# EAGLE schematic MainECU rev11 (EAGLE 9.6.2)

## Sheet 1 of 5
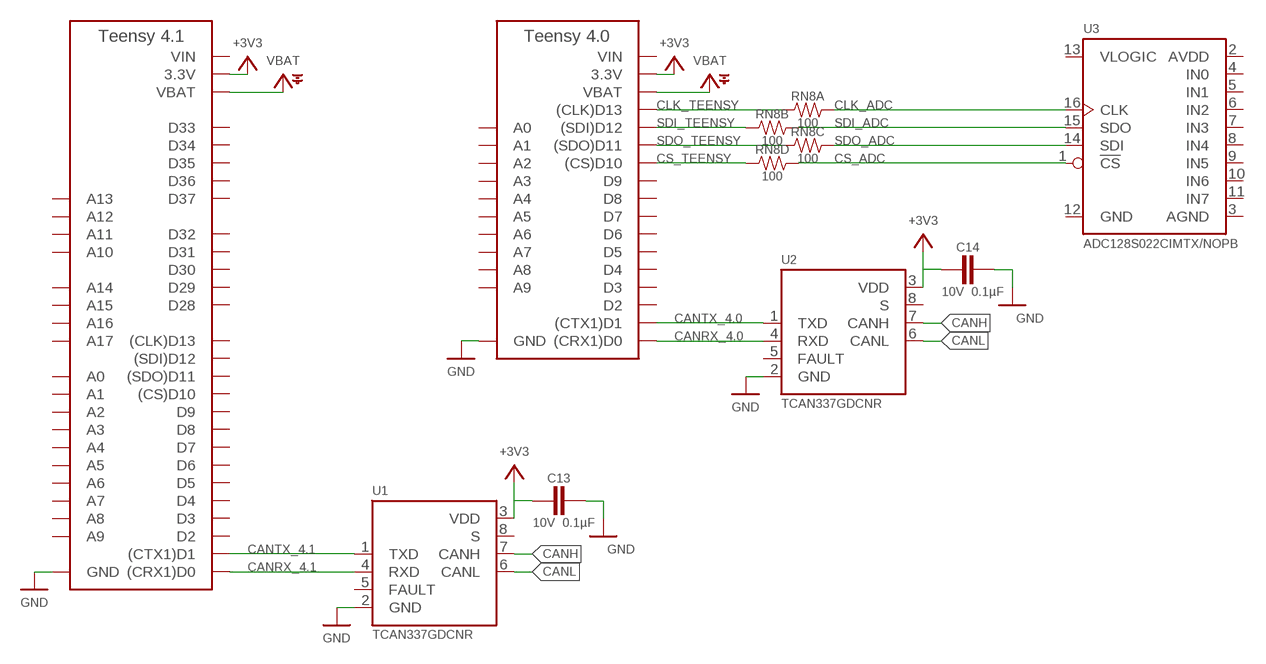
[diagram p0: schematic, sheet 1]

### Parts
A1  TEENSY_4.1  [TEENSY_LONG_EXT]
A2  TEENSY_4.0_VBAT  [TEENSY_SHORT_VBAT]
C13  CAPACITOR_0603_10V_0.1UF  [0603-CAP]
C14  CAPACITOR_0603_10V_0.1UF  [0603-CAP]
RN8  RESISTOR_NETWORK_4_100  [1206-RES]
U1  CAN_TRANSCIEVER_TCAN337G  [SOT-23-8]
U2  CAN_TRANSCIEVER_TCAN337G  [SOT-23-8]
U3  ADC128S022  [TSSOP-16]

### Nets
+3V1: C13.2
+3V2: C14.2
+3V3: A1.3V3(3.3V) A1.3V3@2(3.3V) A1.3V3@3(3.3V) A2.3.3V U1.3(VDD) U2.3(VDD) ; also sheet 2,3,4,5
CANH: U1.7(CANH) U2.7(CANH)
CANL: U1.6(CANL) U2.6(CANL)
CANRX_4.0: A2.D0((CRX1)D0) U2.4(RXD)
CANRX_4.1: A1.D0((CRX1)D0) U1.4(RXD)
CANTX_4.0: A2.D1((CTX1)D1) U2.1(TXD)
CANTX_4.1: A1.D1((CTX1)D1) U1.1(TXD)
CLK_ADC: RN8.8 U3.16(CLK)
CLK_TEENSY: A2.D13((CLK)D13) RN8.1
CS_ADC: RN8.5 U3.1(!CS!)
CS_TEENSY: A2.D10((CS)D10) RN8.4
GND: A1.AGND/GND(GND) A1.GND A1.GND@2(GND) A2.AGND/GND(GND) A2.GND C13.1 C14.1 U1.2(GND) U2.2(GND) ; also sheet 2,3,4,5
SDI_ADC: RN8.7 U3.15(SDO)
SDI_TEENSY: A2.D12((SDI)D12) RN8.2
SDO_ADC: RN8.6 U3.14(SDI)
SDO_TEENSY: A2.D11((SDO)D11) RN8.3
VBAT: A1.VBAT A2.VBAT
Unconnected: A1.D2 A1.D3 A1.D4 A1.D5 A1.D6 A1.D7 A1.D8 A1.D9 A1.D10((CS)D10) A1.D11((SDO)D11) A1.D12((SDI)D12) A1.D13((CLK)D13) A1.D14(A0) A1.D15(A1) A1.D16(A2) A1.D17(A3) A1.D18(A4) A1.D19(A5) A1.D20(A6) A1.D21(A7) A1.D22(A8) A1.D23(A9) A1.D24(A10) A1.D25(A11) A1.D26(A12) A1.D27(A13) A1.D28 A1.D29 A1.D30 A1.D31 A1.D32 A1.D33 A1.D34 A1.D35 A1.D36 A1.D37 A1.D38(A14) A1.D39(A15) A1.D40(A16) A1.D41(A17) A2.D2 A2.D3 A2.D4 A2.D5 A2.D6 A2.D7 A2.D8 A2.D9 A2.D14(A0) A2.D15(A1) A2.D16(A2) A2.D17(A3) A2.D18(A4) A2.D19(A5) A2.D20(A6) A2.D21(A7) A2.D22(A8) A2.D23(A9) U1.5(FAULT) U1.8(S) U2.5(FAULT) U2.8(S) U3.4(IN0) U3.5(IN1) U3.6(IN2) U3.7(IN3) U3.8(IN4) U3.9(IN5) U3.10(IN6) U3.11(IN7)

## Sheet 2 of 5: Wheel speed
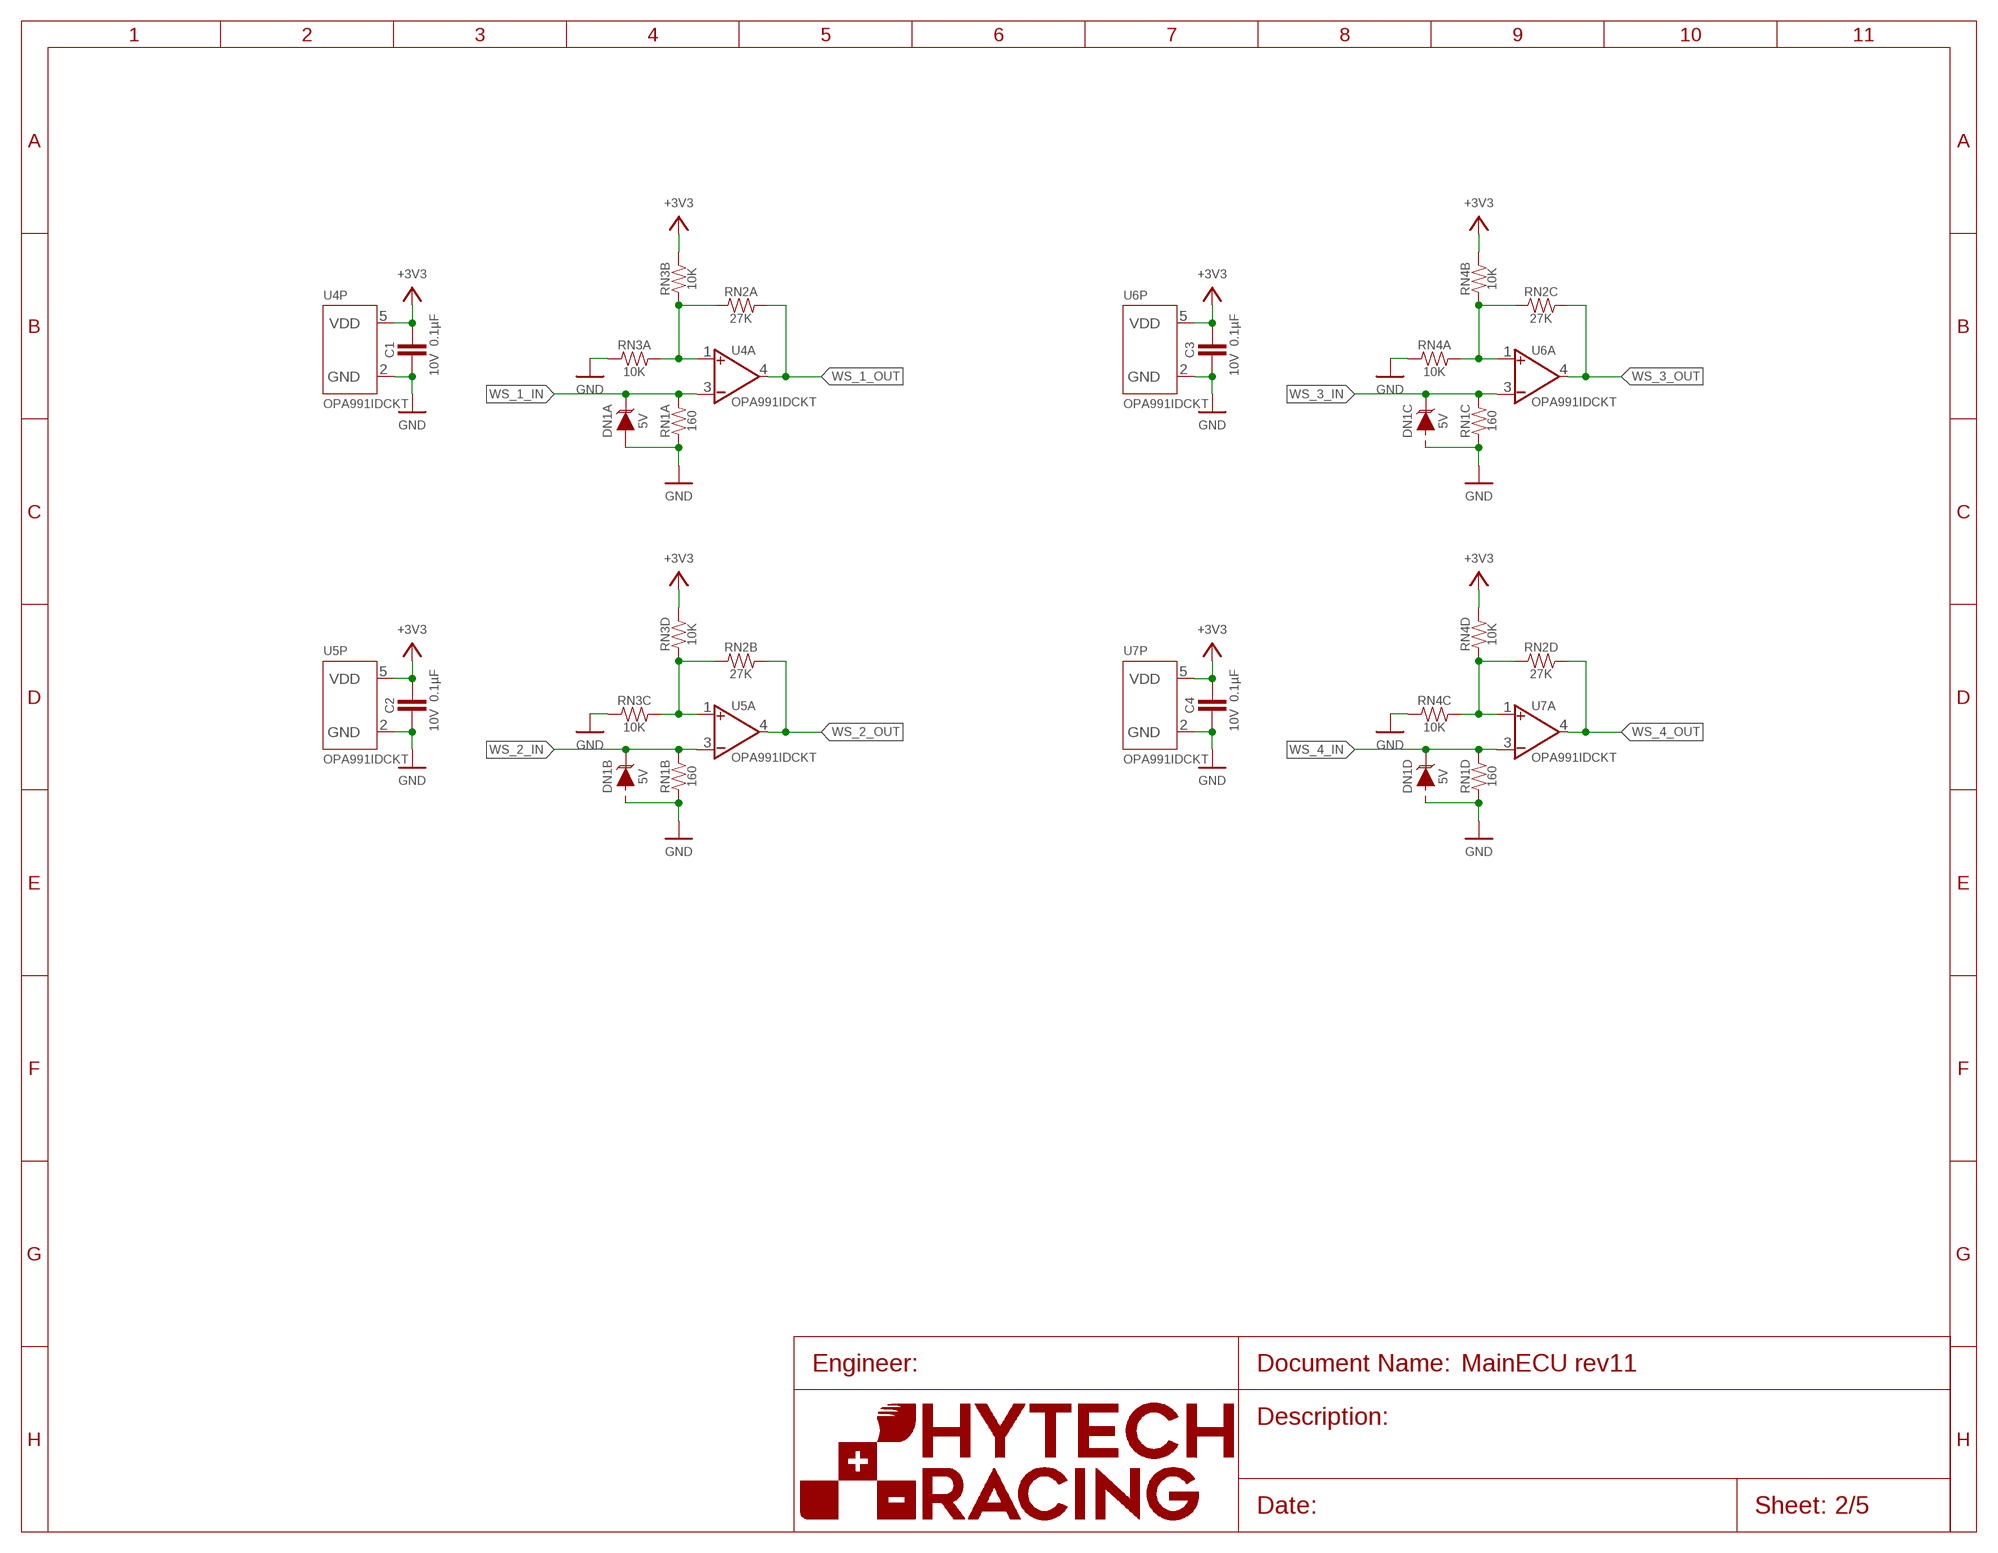
[diagram p1: schematic, sheet 2]
U$3 (FRAME_A): FRAME_DESCRIPTION: Default; ORIENTATION: LANDSCAPE; SIZE: A

### Parts
C1  CAPACITOR_0603_10V_0.1UF  [0603-CAP]
C2  CAPACITOR_0603_10V_0.1UF  [0603-CAP]
C3  CAPACITOR_0603_10V_0.1UF  [0603-CAP]
C4  CAPACITOR_0603_10V_0.1UF  [0603-CAP]
DN1  TVS_ARRAY_5V  [SOT363]
RN1  RESISTOR_NETWORK_4_160  [1206-RES]
RN2  RESISTOR_NETWORK_4_27K  [1206-RES]
RN3  RESISTOR_NETWORK_4_10K  [1206-RES]
RN4  RESISTOR_NETWORK_4_10K  [1206-RES]
U4  OPAMP_1_CHANNEL_OPA991  [SC-70-5]
U5  OPAMP_1_CHANNEL_OPA991  [SC-70-5]
U6  OPAMP_1_CHANNEL_OPA991  [SC-70-5]
U7  OPAMP_1_CHANNEL_OPA991  [SC-70-5]

### Nets
+3V3: C1.1 C2.1 C3.1 C4.1 RN3.5 RN3.7 RN4.5 RN4.7 U4.5(P:VDD) U5.5(P:VDD) U6.5(P:VDD) U7.5(P:VDD) ; also sheet 1,3,4,5
GND: C1.2 C2.2 C3.2 C4.2 DN1.2(A:A) RN1.1 RN1.2 RN1.3 RN1.4 RN3.1 RN3.3 RN4.1 RN4.3 U4.2(P:GND) U5.2(P:GND) U6.2(P:GND) U7.2(P:GND) ; also sheet 1,3,4,5
N$9: RN2.2 RN3.4 RN3.6 U5.1(A:VIN+)
N$10: RN2.3 RN4.2 RN4.8 U6.1(A:VIN+)
N$11: RN2.1 RN3.2 RN3.8 U4.1(A:VIN+)
N$12: RN2.4 RN4.4 RN4.6 U7.1(A:VIN+)
WS_1_IN: DN1.1(A:C) RN1.8 U4.3(A:VIN-)
WS_1_OUT: RN2.8 U4.4(A:VOUT)
WS_2_IN: DN1.3(B:C) RN1.7 U5.3(A:VIN-)
WS_2_OUT: RN2.7 U5.4(A:VOUT)
WS_3_IN: DN1.4(C:C) RN1.6 U6.3(A:VIN-)
WS_3_OUT: RN2.6 U6.4(A:VOUT)
WS_4_IN: DN1.5(D:C) RN1.5 U7.3(A:VIN-)
WS_4_OUT: RN2.5 U7.4(A:VOUT)
Unconnected: DN1.6(E:C)

## Sheet 3 of 5: BSPD
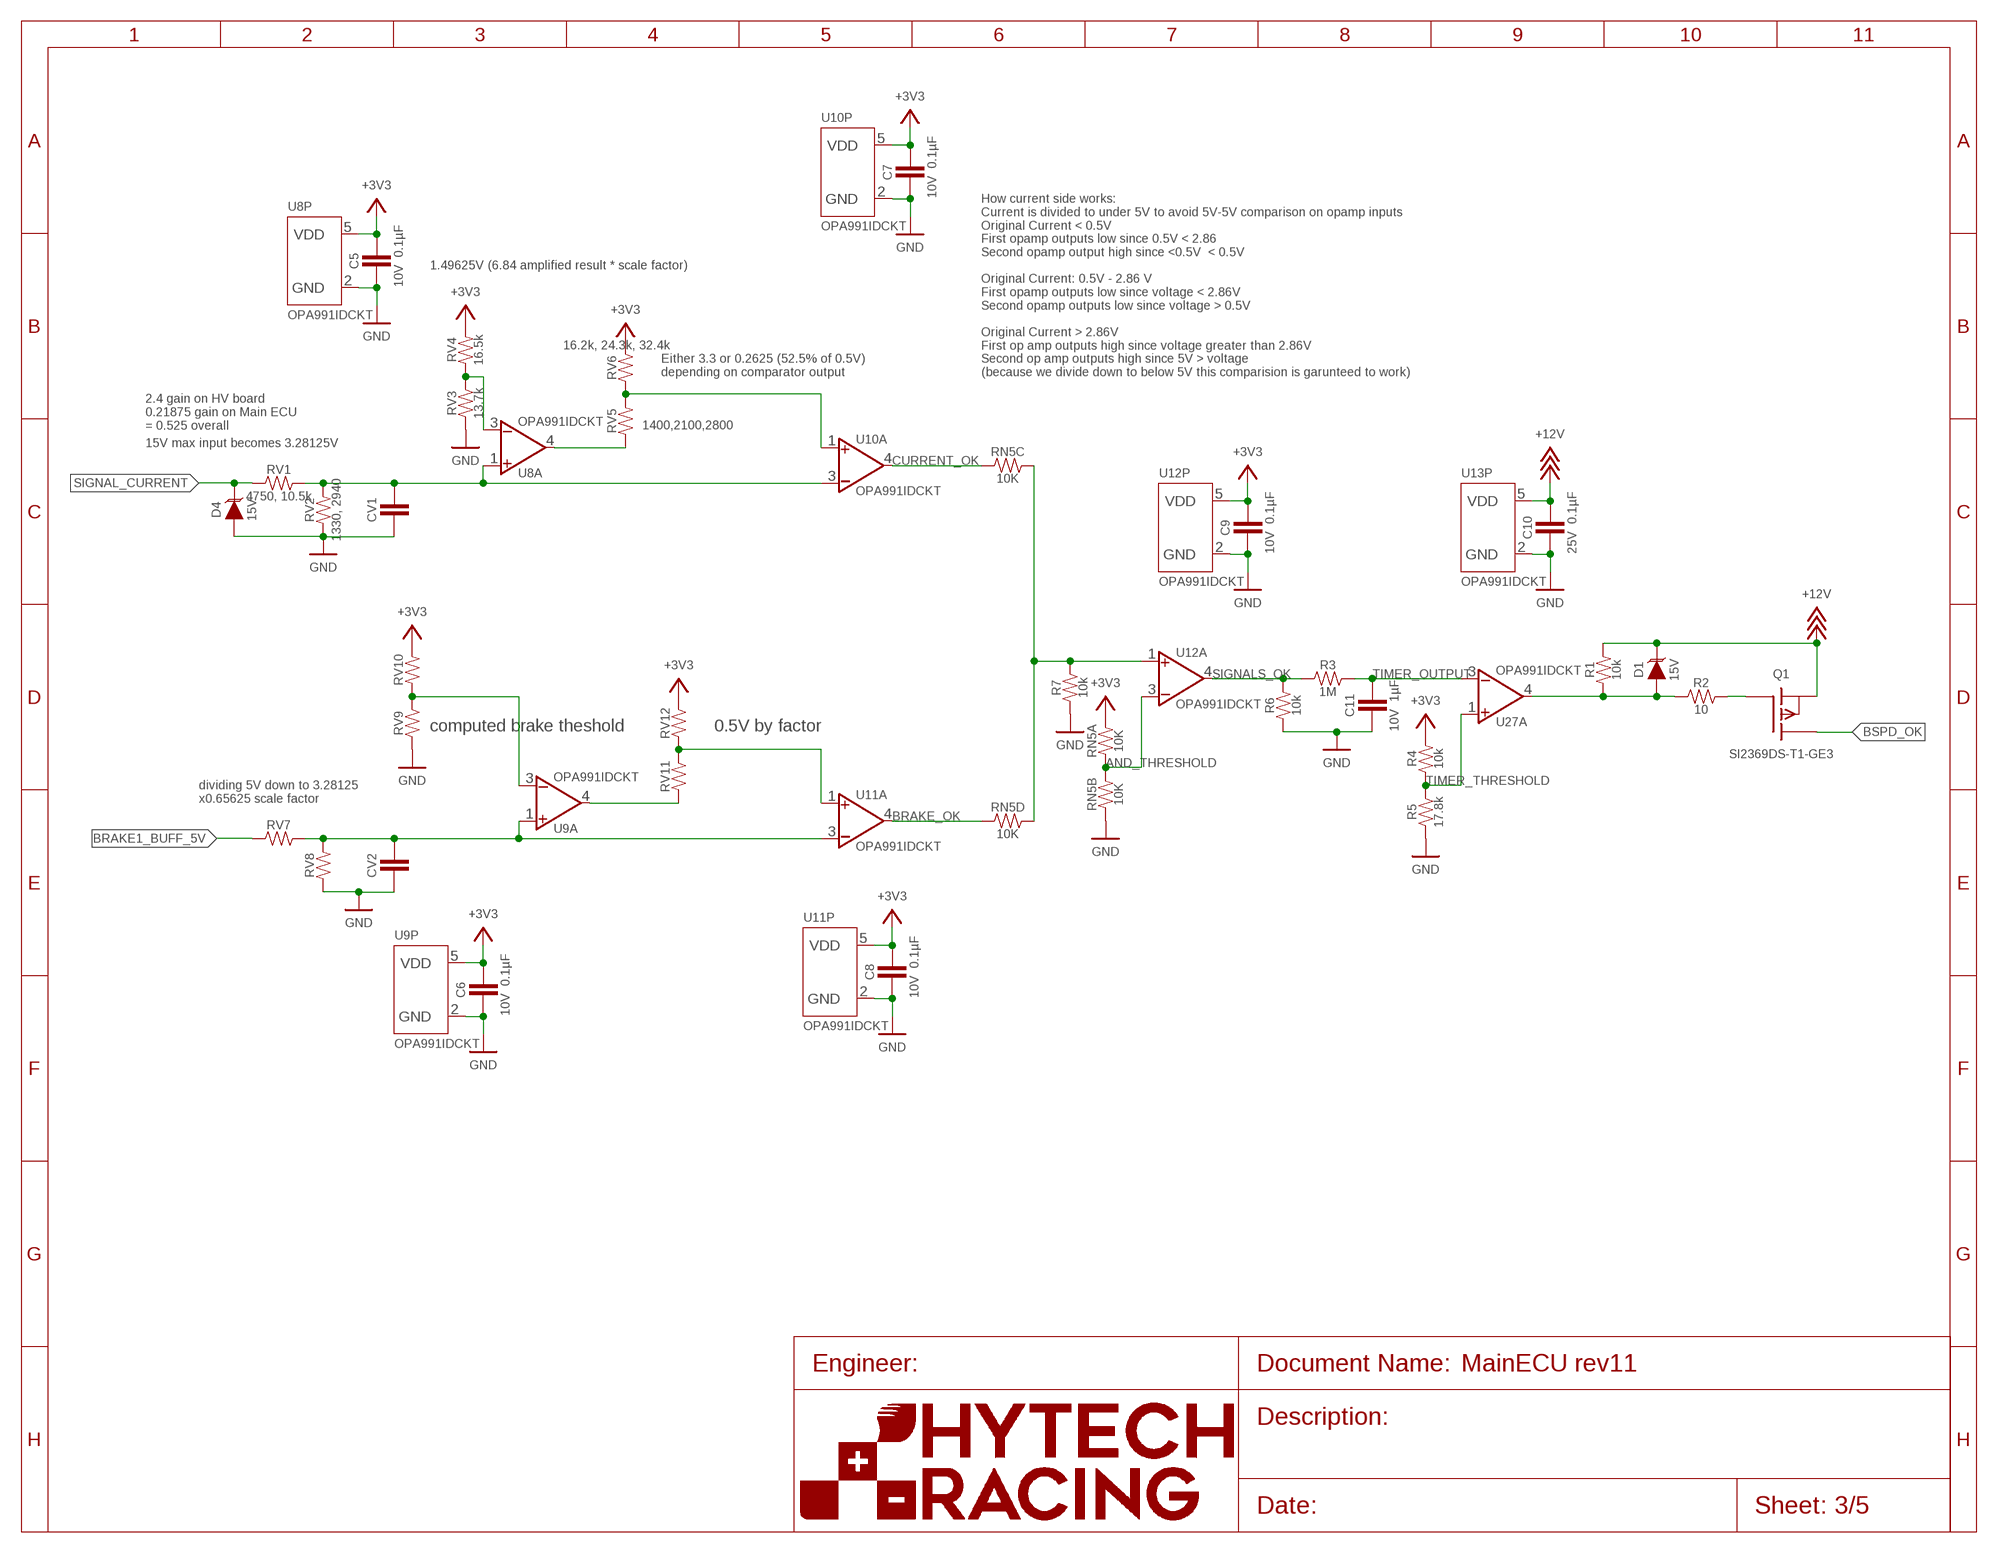
[diagram p2: schematic, sheet 3]
U$4 (FRAME_A): FRAME_DESCRIPTION: Default; ORIENTATION: LANDSCAPE; SIZE: A

### Parts
C5  CAPACITOR_0603_10V_0.1UF  [0603-CAP]
C6  CAPACITOR_0603_10V_0.1UF  [0603-CAP]
C7  CAPACITOR_0603_10V_0.1UF  [0603-CAP]
C8  CAPACITOR_0603_10V_0.1UF  [0603-CAP]
C9  CAPACITOR_0603_10V_0.1UF  [0603-CAP]
C10  CAPACITOR_0603_25V_0.1UF  [0603-CAP]
C11  CAPACITOR_0603_10V_1UF  [0603-CAP]
CV1  CAPACITOR_VALUE  [0603-CAP]
CV2  CAPACITOR_VALUE  [0603-CAP]
D1  TVS_15V  [SOT-23]
D4  TVS_15V  [SOT-23]
Q1  TRANSISTOR_P_MOS_SOT23_SI2369DS-T1-GE3  [SOT-23]
R1  RESISTOR_0603_10K  [0603-RES]
R2  RESISTOR_0603_10  [0603-RES]
R3  RESISTOR_0603_1M  [0603-RES]
R4  RESISTOR_0603_10K  [0603-RES]
R5  RESISTOR_0603_17.8K  [0603-RES]
R6  RESISTOR_0603_10K  [0603-RES]
R7  RESISTOR_0603_10K  [0603-RES]
RN5  RESISTOR_NETWORK_4_10K  [1206-RES]
RV1  4750, 10.5k  RESISTOR_VALUE  [0603-RES]
RV2  1330, 2940  RESISTOR_VALUE  [0603-RES]
RV3  13.7k  RESISTOR_VALUE  [0603-RES]
RV4  16.5k  RESISTOR_VALUE  [0603-RES]
RV5  1400,2100,2800  RESISTOR_VALUE  [0603-RES]
RV6  16.2k, 24.3k, 32.4k  RESISTOR_VALUE  [0603-RES]
RV7  RESISTOR_VALUE  [0603-RES]
RV8  RESISTOR_VALUE  [0603-RES]
RV9  RESISTOR_VALUE  [0603-RES]
RV10  RESISTOR_VALUE  [0603-RES]
RV11  RESISTOR_VALUE  [0603-RES]
RV12  RESISTOR_VALUE  [0603-RES]
U8  OPAMP_1_CHANNEL_OPA991  [SC-70-5]
U9  OPAMP_1_CHANNEL_OPA991  [SC-70-5]
U10  OPAMP_1_CHANNEL_OPA991  [SC-70-5]
U11  OPAMP_1_CHANNEL_OPA991  [SC-70-5]
U12  OPAMP_1_CHANNEL_OPA991  [SC-70-5]
U13  OPAMP_1_CHANNEL_OPA991  [SC-70-5]
U27  OPAMP_1_CHANNEL_OPA991  [SC-70-5]

### Nets
+3V3: C5.1 C6.1 C7.1 C8.1 C9.1 R4.2 RN5.8 RV4.2 RV6.2 RV10.2 RV12.2 U8.5(P:VDD) U9.5(P:VDD) U10.5(P:VDD) U11.5(P:VDD) U12.5(P:VDD) ; also sheet 1,2,4,5
+12V: C10.1 D1.3(C) Q1.2(S) R1.2 U13.5(P:VDD) ; also sheet 4
AND_THRESHOLD: RN5.1 RN5.7 U12.3(A:VIN-)
BRAKE1_BUFF_5V: RV7.1 ; also sheet 5
BRAKE_OK: RN5.4 U11.4(A:VOUT)
BSPD_OK: Q1.3(D)
CURRENT_OK: RN5.3 U10.4(A:VOUT)
GND: C5.2 C6.2 C7.2 C8.2 C9.2 C10.2 C11.2 CV1.2 CV2.2 D4.1(A) R5.1 R6.1 R7.1 RN5.2 RV2.1 RV3.1 RV8.1 RV9.1 U8.2(P:GND) U9.2(P:GND) U10.2(P:GND) U11.2(P:GND) U12.2(P:GND) U13.2(P:GND) ; also sheet 1,2,4,5
N$14: D1.1(A) R1.1 R2.1 U27.4(A:VOUT)
N$15: Q1.1(G) R2.2
N$19: R7.2 RN5.5 RN5.6 U12.1(A:VIN+)
N$23: RV3.2 RV4.1 U8.3(A:VIN-)
N$24: RV5.1 U8.4(A:VOUT)
N$25: RV5.2 RV6.1 U10.1(A:VIN+)
N$26: CV1.1 RV1.2 RV2.2 U8.1(A:VIN+) U10.3(A:VIN-)
N$28: RV9.2 RV10.1 U9.3(A:VIN-)
N$29: RV11.2 RV12.1 U11.1(A:VIN+)
N$30: CV2.1 RV7.2 RV8.2 U9.1(A:VIN+) U11.3(A:VIN-)
N$31: RV11.1 U9.4(A:VOUT)
SIGNAL_CURRENT: D4.3(C) RV1.1
SIGNALS_OK: R3.1 R6.2 U12.4(A:VOUT)
TIMER_OUTPUT: C11.1 R3.2 U27.3(A:VIN-)
TIMER_THRESHOLD: R4.1 R5.2 U27.1(A:VIN+)
Unconnected: U13.1(A:VIN+) U13.3(A:VIN-) U13.4(A:VOUT)

### Notes on the sheet
- 1.49625V (6.84 amplified result * scale factor)
- Either 3.3 or 0.2625 (52.5% of 0.5V)
  depending on comparator output
- How current side works:
  Current is divided to under 5V to avoid 5V-5V comparison on opamp inputs
  Original Current < 0.5V
  First opamp outputs low since 0.5V < 2.86
  Second opamp output high since <0.5V  < 0.5V
  
  Original Current: 0.5V - 2.86 V
  First opamp outputs low since voltage < 2.86V
  Second opamp outputs low since voltage > 0.5V
  
  Original Current > 2.86V
  First op amp outputs high since voltage greater than 2.86V
  Second op amp outputs high since 5V > voltage
  (because we divide down to below 5V this comparision is garunteed to work)
- 2.4 gain on HV board
  0.21875 gain on Main ECU
  = 0.525 overall
- 15V max input becomes 3.28125V
- computed brake theshold | 0.5V by factor
- dividing 5V down to 3.28125
  x0.65625 scale factor

## Sheet 4 of 5: Software shutdown
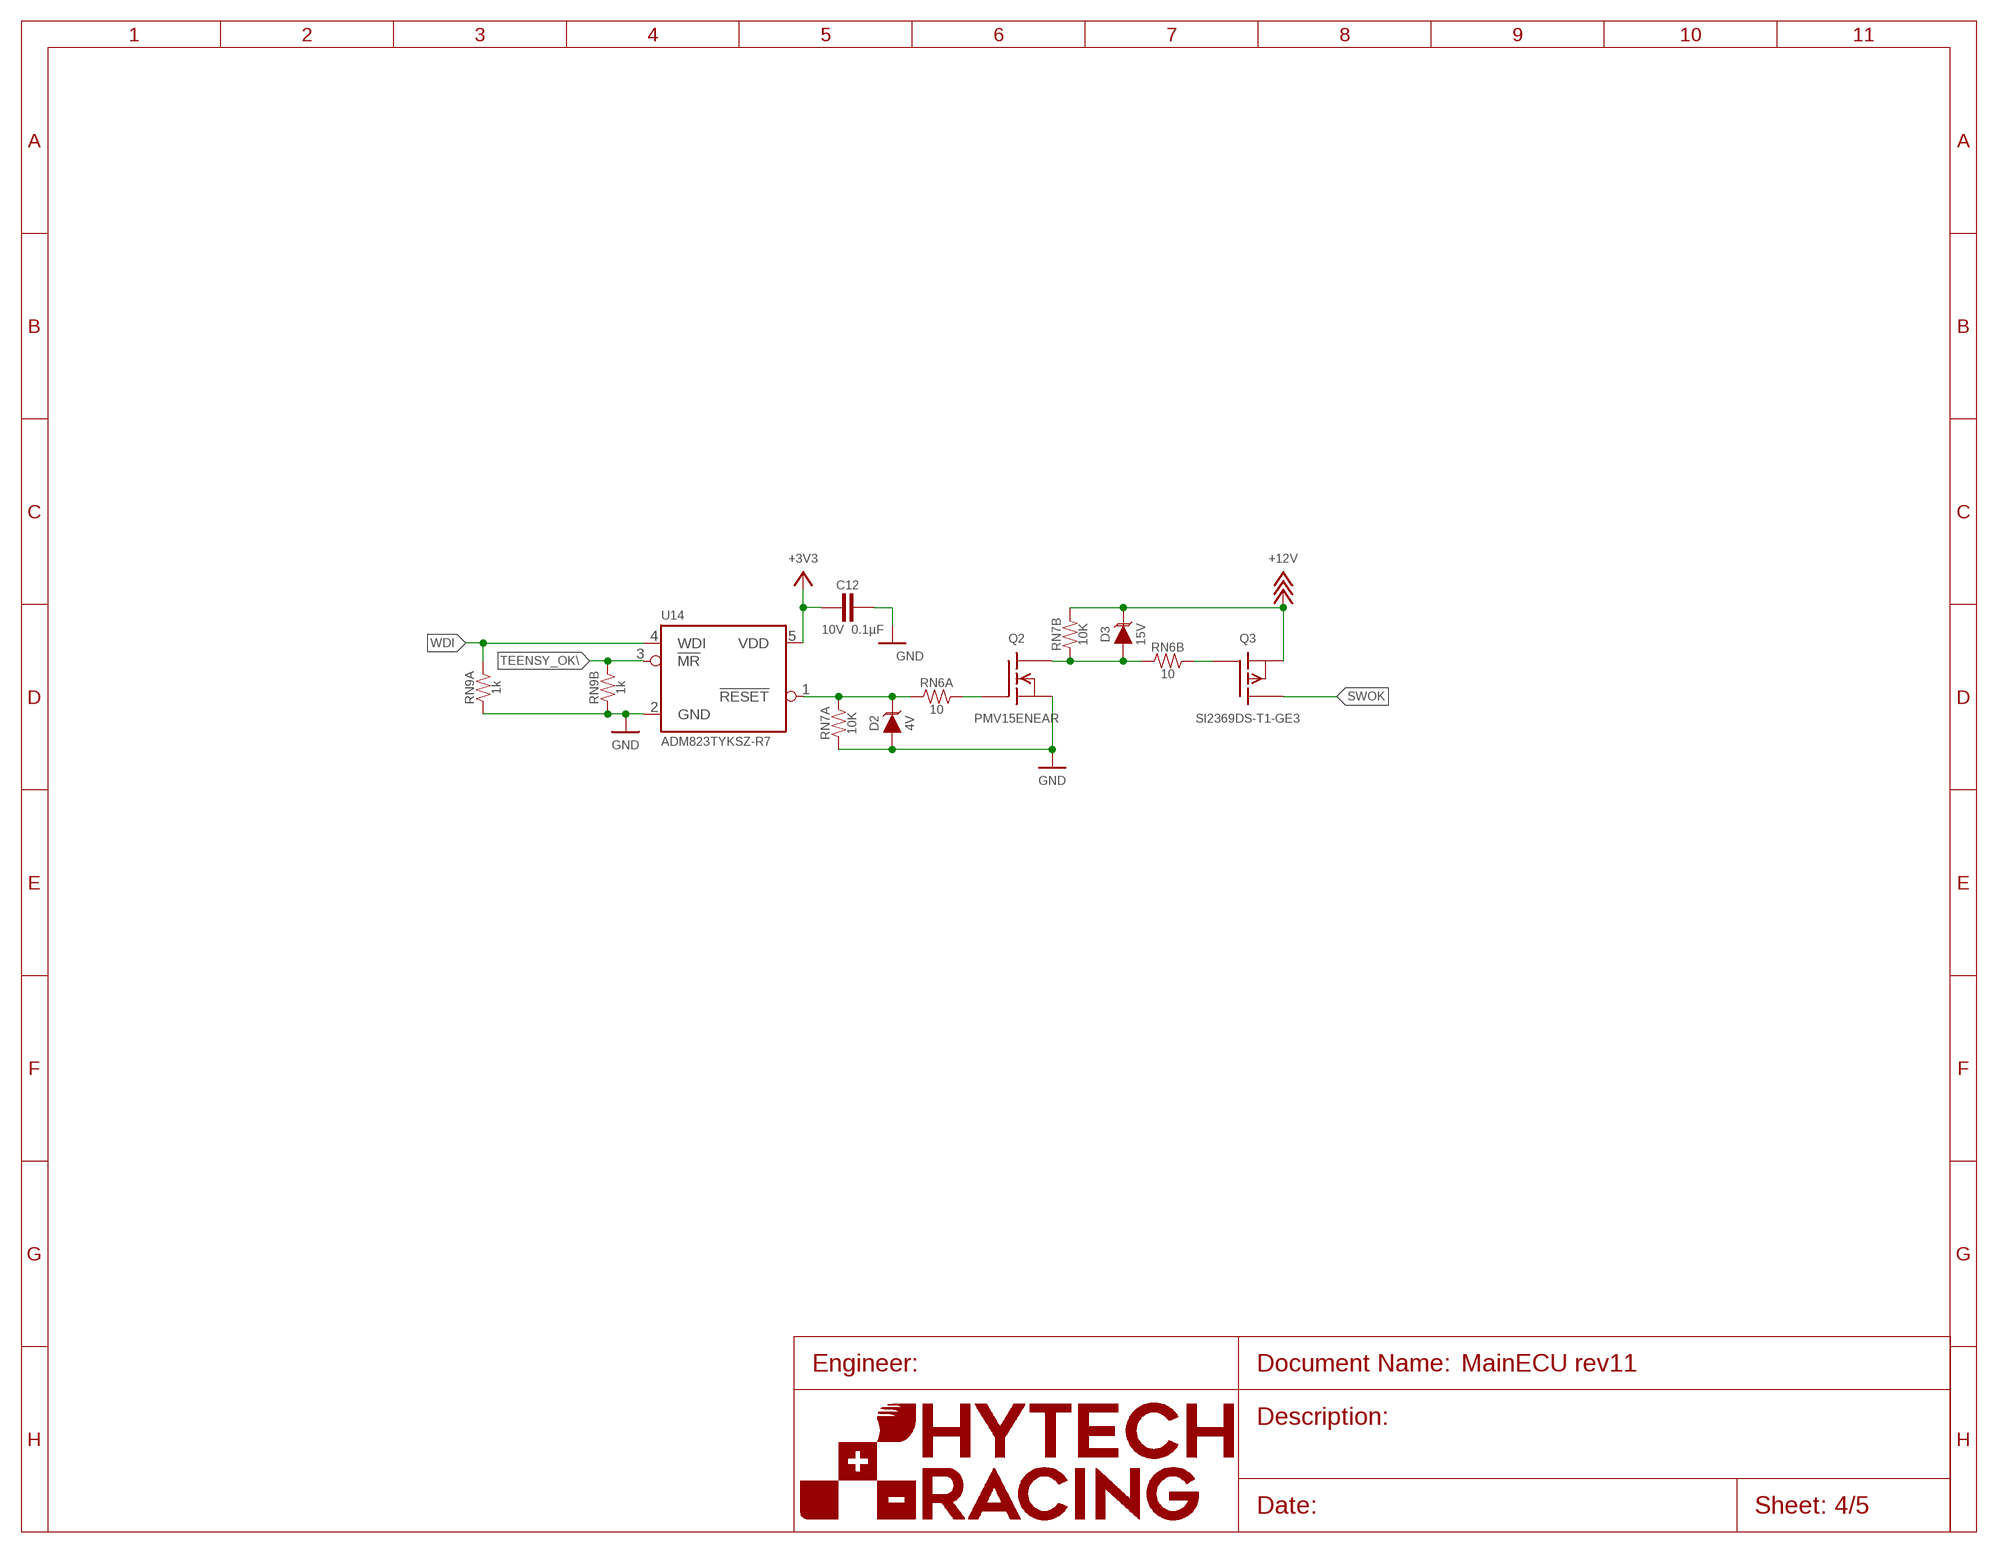
[diagram p3: schematic, sheet 4]
U$5 (FRAME_A): FRAME_DESCRIPTION: Default; ORIENTATION: LANDSCAPE; SIZE: A

### Parts
C12  CAPACITOR_0603_10V_0.1UF  [0603-CAP]
D2  TVS_4V  [SOT-23]
D3  TVS_15V  [SOT-23]
Q2  TRANSISTOR_N_MOS_PMV15ENEA  [SOT-23]
Q3  TRANSISTOR_P_MOS_SOT23_SI2369DS-T1-GE3  [SOT-23]
RN6  RESISTOR_NETWORK_4_10  [1206-RES]
RN7  RESISTOR_NETWORK_4_10K  [1206-RES]
RN9  RESISTOR_NETWORK_4_1K  [1206-RES]
U14  ADM823  [SC-70-5]

### Nets
+3V3: C12.2 U14.5(VDD) ; also sheet 1,2,3,5
+12V: D3.3(C) Q3.2(S) RN7.7 ; also sheet 3
GND: C12.1 D2.1(A) Q2.2(S) RN7.1 RN9.1 RN9.2 U14.2(GND) ; also sheet 1,2,3,5
N$34: D2.3(C) RN6.1 RN7.8 U14.1(!RESET!)
N$36: D3.1(A) Q2.3(D) RN6.2 RN7.2
N$37: Q2.1(G) RN6.8
N$38: Q3.1(G) RN6.7
SWOK: Q3.3(D)
TEENSY_OK\: RN9.7 U14.3(!MR!)
WDI: RN9.8 U14.4(WDI)
Unconnected: RN6.3 RN6.4 RN6.5 RN6.6 RN7.3 RN7.4 RN7.5 RN7.6 RN9.3 RN9.4 RN9.5 RN9.6

## Sheet 5 of 5: Analog signal chain
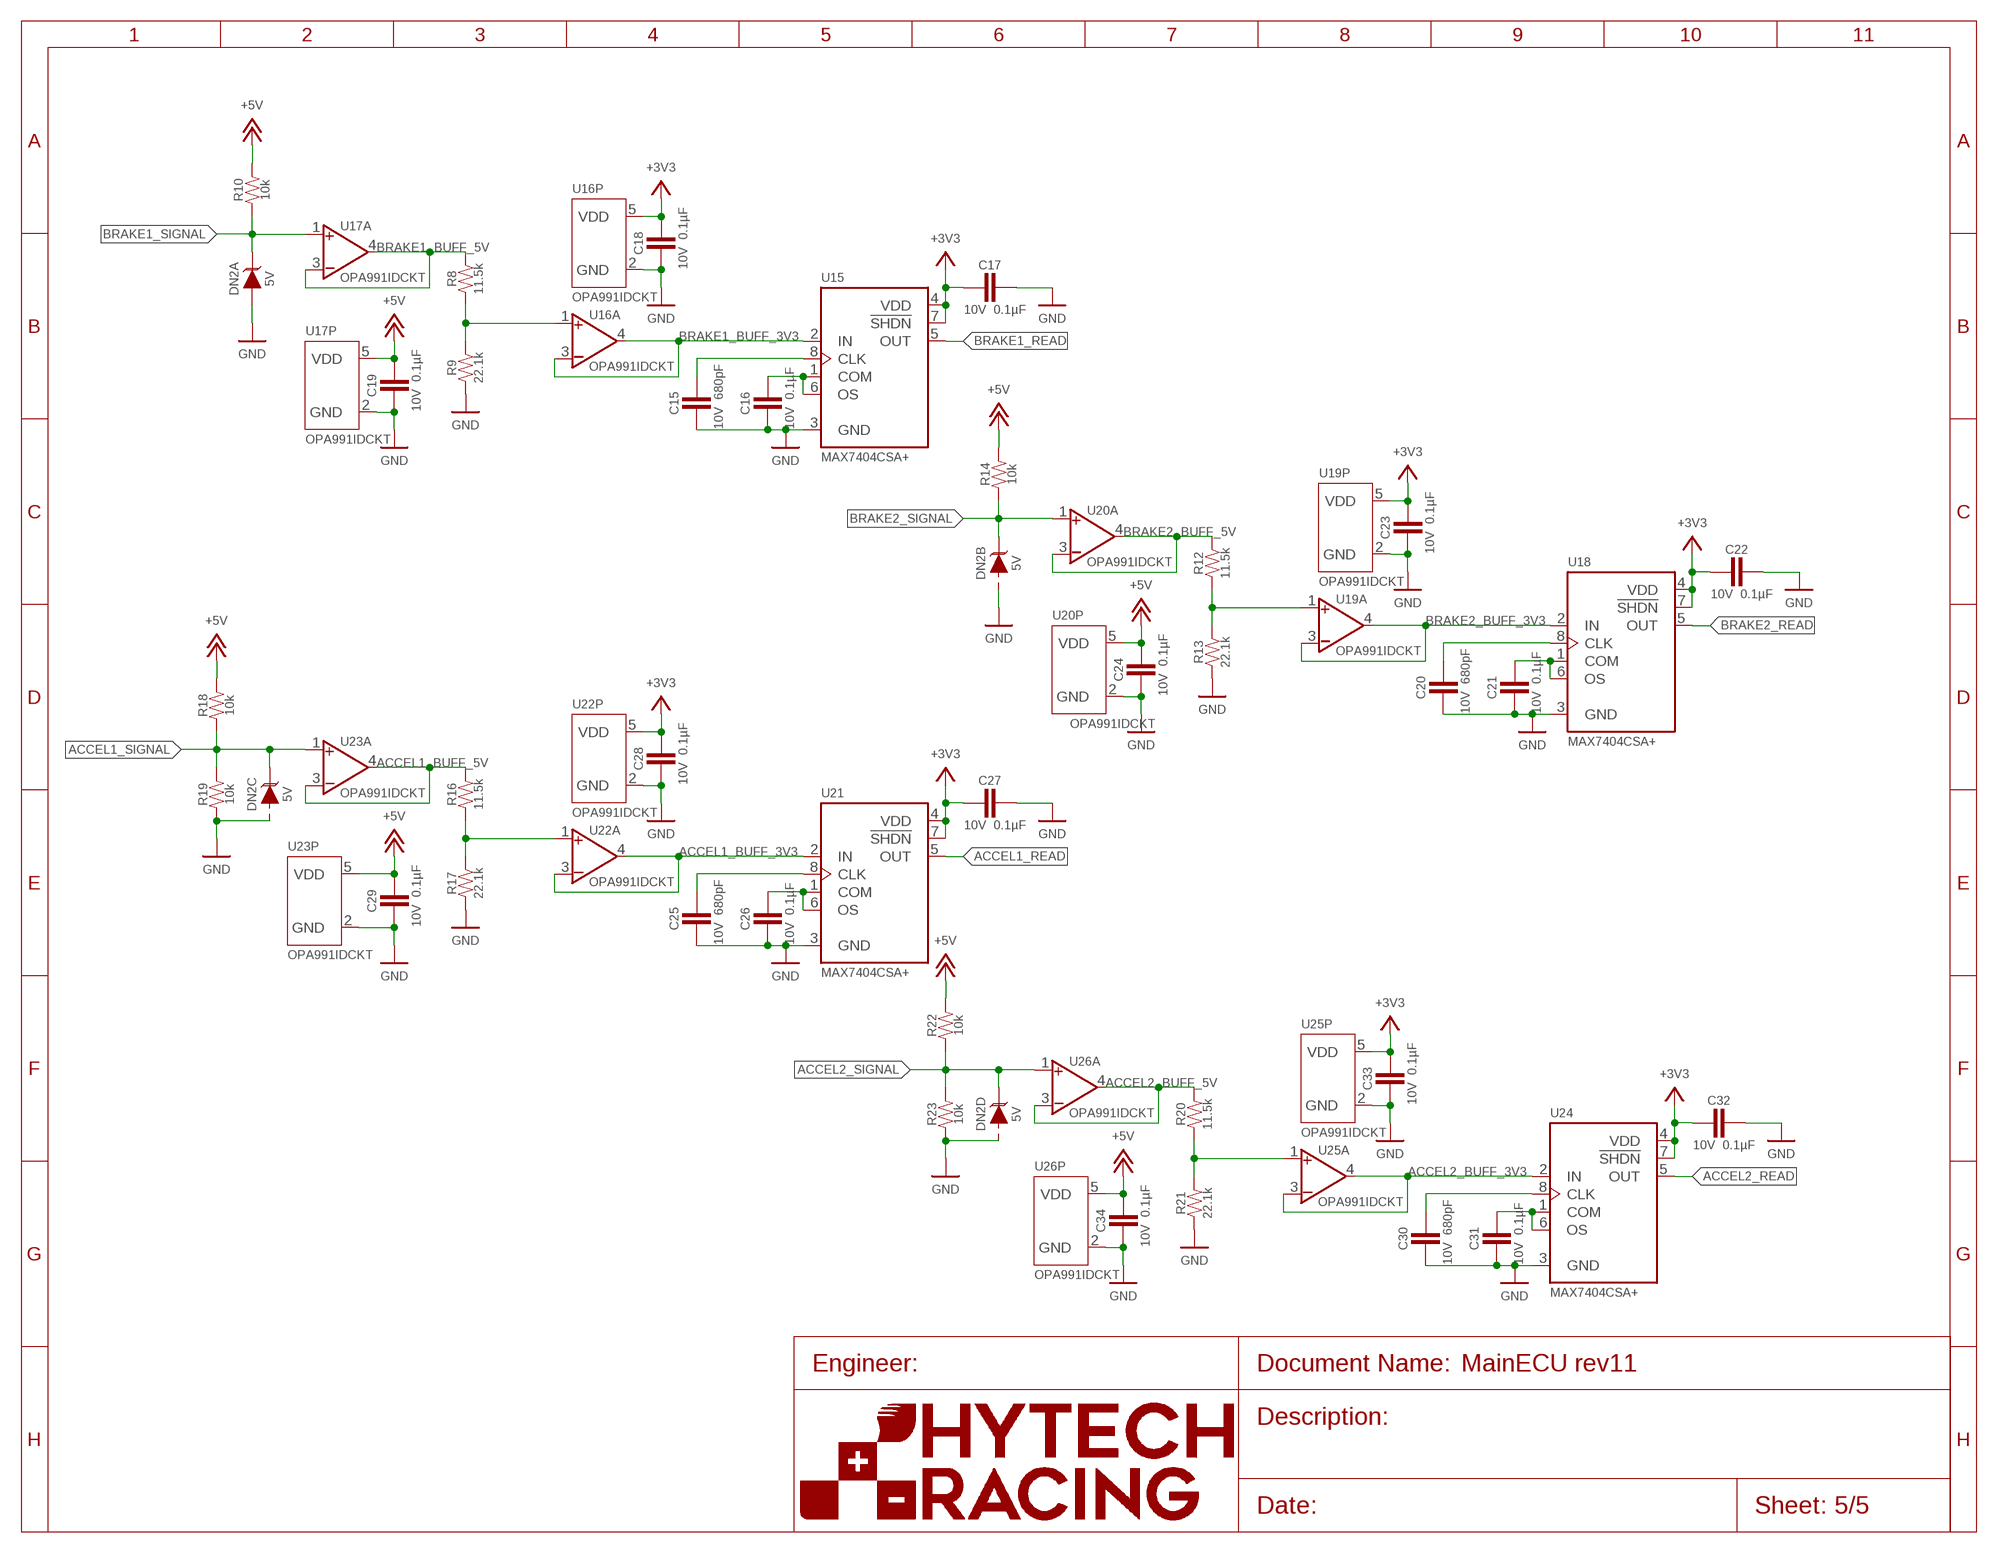
[diagram p4: schematic, sheet 5]
U$6 (FRAME_A): FRAME_DESCRIPTION: Default; ORIENTATION: LANDSCAPE; SIZE: A

### Parts
C15  CAPACITOR_0603_10V_680PF  [0603-CAP]
C16  CAPACITOR_0603_10V_0.1UF  [0603-CAP]
C17  CAPACITOR_0603_10V_0.1UF  [0603-CAP]
C18  CAPACITOR_0603_10V_0.1UF  [0603-CAP]
C19  CAPACITOR_0603_10V_0.1UF  [0603-CAP]
C20  CAPACITOR_0603_10V_680PF  [0603-CAP]
C21  CAPACITOR_0603_10V_0.1UF  [0603-CAP]
C22  CAPACITOR_0603_10V_0.1UF  [0603-CAP]
C23  CAPACITOR_0603_10V_0.1UF  [0603-CAP]
C24  CAPACITOR_0603_10V_0.1UF  [0603-CAP]
C25  CAPACITOR_0603_10V_680PF  [0603-CAP]
C26  CAPACITOR_0603_10V_0.1UF  [0603-CAP]
C27  CAPACITOR_0603_10V_0.1UF  [0603-CAP]
C28  CAPACITOR_0603_10V_0.1UF  [0603-CAP]
C29  CAPACITOR_0603_10V_0.1UF  [0603-CAP]
C30  CAPACITOR_0603_10V_680PF  [0603-CAP]
C31  CAPACITOR_0603_10V_0.1UF  [0603-CAP]
C32  CAPACITOR_0603_10V_0.1UF  [0603-CAP]
C33  CAPACITOR_0603_10V_0.1UF  [0603-CAP]
C34  CAPACITOR_0603_10V_0.1UF  [0603-CAP]
DN2  TVS_ARRAY_5V  [SOT363]
R8  RESISTOR_0603_11.5K  [0603-RES]
R9  RESISTOR_0603_22.1K  [0603-RES]
R10  RESISTOR_0603_10K  [0603-RES]
R12  RESISTOR_0603_11.5K  [0603-RES]
R13  RESISTOR_0603_22.1K  [0603-RES]
R14  RESISTOR_0603_10K  [0603-RES]
R16  RESISTOR_0603_11.5K  [0603-RES]
R17  RESISTOR_0603_22.1K  [0603-RES]
R18  RESISTOR_0603_10K  [0603-RES]
R19  RESISTOR_0603_10K  [0603-RES]
R20  RESISTOR_0603_11.5K  [0603-RES]
R21  RESISTOR_0603_22.1K  [0603-RES]
R22  RESISTOR_0603_10K  [0603-RES]
R23  RESISTOR_0603_10K  [0603-RES]
U15  MAX7404  [SOIC-08]
U16  OPAMP_1_CHANNEL_OPA991  [SC-70-5]
U17  OPAMP_1_CHANNEL_OPA991  [SC-70-5]
U18  MAX7404  [SOIC-08]
U19  OPAMP_1_CHANNEL_OPA991  [SC-70-5]
U20  OPAMP_1_CHANNEL_OPA991  [SC-70-5]
U21  MAX7404  [SOIC-08]
U22  OPAMP_1_CHANNEL_OPA991  [SC-70-5]
U23  OPAMP_1_CHANNEL_OPA991  [SC-70-5]
U24  MAX7404  [SOIC-08]
U25  OPAMP_1_CHANNEL_OPA991  [SC-70-5]
U26  OPAMP_1_CHANNEL_OPA991  [SC-70-5]

### Nets
+3V3: C17.2 C18.1 C22.2 C23.1 C27.2 C28.1 C32.2 C33.1 U15.4(VDD) U15.7(!SHDN) U16.5(P:VDD) U18.4(VDD) U18.7(!SHDN) U19.5(P:VDD) U21.4(VDD) U21.7(!SHDN) U22.5(P:VDD) U24.4(VDD) U24.7(!SHDN) U25.5(P:VDD) ; also sheet 1,2,3,4
+5V: C19.1 C24.1 C29.1 C34.1 R10.2 R14.2 R18.2 R22.2 U17.5(P:VDD) U20.5(P:VDD) U23.5(P:VDD) U26.5(P:VDD)
ACCEL1_BUFF_3V3: U21.2(IN) U22.3(A:VIN-) U22.4(A:VOUT)
ACCEL1_BUFF_5V: R16.2 U23.3(A:VIN-) U23.4(A:VOUT)
ACCEL1_READ: U21.5(OUT)
ACCEL1_SIGNAL: DN2.4(C:C) R18.1 R19.2 U23.1(A:VIN+)
ACCEL2_BUFF_3V3: U24.2(IN) U25.3(A:VIN-) U25.4(A:VOUT)
ACCEL2_BUFF_5V: R20.2 U26.3(A:VIN-) U26.4(A:VOUT)
ACCEL2_READ: U24.5(OUT)
ACCEL2_SIGNAL: DN2.5(D:C) R22.1 R23.2 U26.1(A:VIN+)
BRAKE1_BUFF_3V3: U15.2(IN) U16.3(A:VIN-) U16.4(A:VOUT)
BRAKE1_BUFF_5V: R8.2 U17.3(A:VIN-) U17.4(A:VOUT) ; also sheet 3
BRAKE1_READ: U15.5(OUT)
BRAKE1_SIGNAL: DN2.1(A:C) R10.1 U17.1(A:VIN+)
BRAKE2_BUFF_3V3: U18.2(IN) U19.3(A:VIN-) U19.4(A:VOUT)
BRAKE2_BUFF_5V: R12.2 U20.3(A:VIN-) U20.4(A:VOUT)
BRAKE2_READ: U18.5(OUT)
BRAKE2_SIGNAL: DN2.3(B:C) R14.1 U20.1(A:VIN+)
GND: C15.2 C16.2 C17.1 C18.2 C19.2 C20.2 C21.2 C22.1 C23.2 C24.2 C25.2 C26.2 C27.1 C28.2 C29.2 C30.2 C31.2 C32.1 C33.2 C34.2 DN2.2(A:A) R9.1 R13.1 R17.1 R19.1 R21.1 R23.1 U15.3(GND) U16.2(P:GND) U17.2(P:GND) U18.3(GND) U19.2(P:GND) U20.2(P:GND) U21.3(GND) U22.2(P:GND) U23.2(P:GND) U24.3(GND) U25.2(P:GND) U26.2(P:GND) ; also sheet 1,2,3,4
N$1: C16.1 U15.1(COM) U15.6(OS)
N$2: C21.1 U18.1(COM) U18.6(OS)
N$3: C15.1 U15.8(CLK)
N$4: C20.1 U18.8(CLK)
N$5: R12.1 R13.2 U19.1(A:VIN+)
N$6: R8.1 R9.2 U16.1(A:VIN+)
N$7: C26.1 U21.1(COM) U21.6(OS)
N$8: C25.1 U21.8(CLK)
N$33: R16.1 R17.2 U22.1(A:VIN+)
N$35: C31.1 U24.1(COM) U24.6(OS)
N$40: C30.1 U24.8(CLK)
N$41: R20.1 R21.2 U25.1(A:VIN+)
Unconnected: DN2.6(E:C)

## Power pins joined to a net without a drawn wire
AGND: U3.3(AGND)
AVDD: U3.2(AVDD)
GND: U3.12(GND) U27.2(P:GND)
VDD: U27.5(P:VDD)
VIN: A1.VIN A2.VIN
VLOGIC: U3.13(VLOGIC)

## Library data of the parts
A1 = HyTechDevices:TEENSY_4.1: Teensy 4.1 with VBAT Datasheet; TEENSY: 4.1
A2 = HyTechDevices:TEENSY_4.0_VBAT: Teensy 4.0 with VBAT Pin Datasheet
C1-C9 C12-C14 C16-C19 C21-C24 C26-C29 C31-C34 = HyTechDevices:CAPACITOR_?_*: Capacitor, Non-Polarized VJ...1BC Series Datasheet Samsung Datasheet Walsin Datasheet GRM188R61A226ME15D GRM188R61E106MA73D 885012006013; CAPACITANCE: 0.1µF; DKPN: 720-1688-1-ND; MANUFACTURER: Vishay Vitramon; MOPN: 77-VJ0603Y104JXQPBC; MPN: VJ0603Y104JXQPW1BC; TOLERANCE: 5%; VOLTAGE: 10V
C10 = HyTechDevices:CAPACITOR_?_*: Capacitor, Non-Polarized VJ...1BC Series Datasheet Samsung Datasheet Walsin Datasheet GRM188R61A226ME15D GRM188R61E106MA73D 885012006013; CAPACITANCE: 0.1µF; DKPN: 1276-1006-1-ND; MANUFACTURER: Samsung Electro-Mechanics; MOPN: 187-CL10B104KA8NNNC; MPN: CL10B104KA8NNNC; TOLERANCE: 10%; VOLTAGE: 25V
C11 = HyTechDevices:CAPACITOR_?_*: Capacitor, Non-Polarized VJ...1BC Series Datasheet Samsung Datasheet Walsin Datasheet GRM188R61A226ME15D GRM188R61E106MA73D 885012006013; CAPACITANCE: 1µF; DKPN: 311-1796-1-ND; MANUFACTURER: Yageo; MOPN: 603-CC603KRX7R6BB105; MPN: CC0603KRX7R6BB105; TOLERANCE: 10%; VOLTAGE: 10V
C15 C20 C25 C30 = HyTechDevices:CAPACITOR_?_*: Capacitor, Non-Polarized VJ...1BC Series Datasheet Samsung Datasheet Walsin Datasheet GRM188R61A226ME15D GRM188R61E106MA73D 885012006013; CAPACITANCE: 680pF; DKPN: 732-7757-1-ND; MANUFACTURER: Würth Elektronik; MOPN: 710-885012006013; MPN: 885012006013; TOLERANCE: 5%; VOLTAGE: 10V
CV1 CV2 = HyTechDevices:CAPACITOR_VALUE: Capacitor for prototyping circuits
D1 D3 D4 = HyTechDevices:TVS_*: TVS Diode GSOT Datasheet; DKPN: GSOT15-E3-08CT-ND; MANUFACTURER: Vishay General Semiconductor - Diodes Division; MOPN: 78-GSOT15-E3-08; MPN: GSOT15-E3-08; VOLTAGE: 15V
D2 = HyTechDevices:TVS_*: TVS Diode GSOT Datasheet; DKPN: GSOT04-E3-08CT-ND; MANUFACTURER: Vishay General Semiconductor - Diodes Division; MOPN: 78-GSOT04-E3-08; MPN: GSOT04-E3-08; VOLTAGE: 4V
DN1 DN2 = HyTechDevices:TVS_ARRAY_*: TVS Diode Array Datasheet; DKPN: 112-VESD05A5-06G-G3-08CT-ND; MANUFACTURER: Vishay General Semiconductor - Diodes Division; MOPN: 78-VESD05A5-06G-G308; MPN: VESD05A5-06G-G3-08; VOLTAGE: 5V
Q1 Q3 = HyTechDevices:TRANSISTOR_P_MOS_?_*: MOSFET P Channel Datasheet; DKPN: SI2369DS-T1-GE3CT-ND; MANUFACTURER: Vishay Siliconix; MOPN: 78-SI2369DS-T1-GE3; MPN: SI2369DS-T1-GE3
Q2 = HyTechDevices:TRANSISTOR_N_MOS_*: N-MOSFET PMV15ENEA Datasheet; DKPN: 1727-8588-1-ND; MANUFACTURER: Nexperia USA Inc.; MOPN: 771-PMV15ENEAR; MPN: PMV15ENEAR
R1 R4 R6 R7 R10 R14 R18 R19 R22 R23 = HyTechDevices:RESISTOR_?_*: Resistor PWR163 Series AC Series PU Series ERA Series; DKPN: 311-10.0KHRCT-ND; MANUFACTURER: Yageo; MOPN: 603-RC0603FR-0710KL; MPN: RC0603FR-0710KL; POWER: 0.1W; RESISTANCE: 10k; TOLERANCE: 1%; VOLTAGE: 75V
R2 = HyTechDevices:RESISTOR_?_*: Resistor PWR163 Series AC Series PU Series ERA Series; DKPN: 311-10.0HRCT-ND; MANUFACTURER: Yageo; MOPN: 603-RC0603FR-0710RL; MPN: RC0603FR-0710RL; POWER: 0.1W; RESISTANCE: 10; TOLERANCE: 1%; VOLTAGE: 75V
R3 = HyTechDevices:RESISTOR_?_*: Resistor PWR163 Series AC Series PU Series ERA Series; DKPN: 311-1.00MHRCT-ND; MANUFACTURER: Yageo; MOPN: 603-RC0603FR-071ML; MPN: RC0603FR-071ML; POWER: 0.1W; RESISTANCE: 1M; TOLERANCE: 1%; VOLTAGE: 75V
R5 = HyTechDevices:RESISTOR_?_*: Resistor PWR163 Series AC Series PU Series ERA Series; DKPN: 311-17.8KHRCT-ND; MANUFACTURER: Yageo; MOPN: 603-RC0603FR-0717K8L; MPN: RC0603FR-0717K8L; POWER: 0.1W; RESISTANCE: 17.8k; TOLERANCE: 1%; VOLTAGE: 75V
R8 R12 R16 R20 = HyTechDevices:RESISTOR_?_*: Resistor PWR163 Series AC Series PU Series ERA Series; DKPN: P11.5KDBCT-ND; MANUFACTURER: Panasonic Electronic Components; MOPN: 667-ERA-3AEB1152V; MPN: ERA-3AEB1152V; POWER: 0.1W; RESISTANCE: 11.5k; TOLERANCE: 0.1%; VOLTAGE: 75V
R9 R13 R17 R21 = HyTechDevices:RESISTOR_?_*: Resistor PWR163 Series AC Series PU Series ERA Series; DKPN: P22.1KDBCT-ND; MANUFACTURER: Panasonic Electronic Components; MOPN: 667-ERA-3AEB2212V; MPN: ERA-3AEB2212V; POWER: 0.1W; RESISTANCE: 22.1k; TOLERANCE: 0.1W; VOLTAGE: 75V
RN1 = HyTechDevices:RESISTOR_NETWORK_4_*: Resistor Network, 4 Elements YC/TC Series CAT/CAY 16 Series; DKPN: YC164J-160CT-ND; MANUFACTURER: Yageo; MOPN: 603-YC164-JR-07160RL; MPN: YC164-JR-07160RL; POWER: 1/16W; RESISTANCE: 160; TOLERANCE: 5%; VOLTAGE: 50V
RN2 = HyTechDevices:RESISTOR_NETWORK_4_*: Resistor Network, 4 Elements YC/TC Series CAT/CAY 16 Series; DKPN: CAT16-2702F4LFCT-ND; MANUFACTURER: Bourns Inc.; MOPN: 652-CAT16-2702F4LF; MPN: CAT16-2702F4LF; POWER: 1/16W; RESISTANCE: 27K; TOLERANCE: 1%; VOLTAGE: 50V
RN3-RN5 RN7 = HyTechDevices:RESISTOR_NETWORK_4_*: Resistor Network, 4 Elements YC/TC Series CAT/CAY 16 Series; DKPN: YAG3410CT-ND; MANUFACTURER: Yageo; MOPN: 603-TC164-FR-0710KL; MPN: TC164-FR-0710KL; POWER: 1/16W; RESISTANCE: 10K; TOLERANCE: 1%; VOLTAGE: 50V
RN6 = HyTechDevices:RESISTOR_NETWORK_4_*: Resistor Network, 4 Elements YC/TC Series CAT/CAY 16 Series; DKPN: CAT16-100J4LFCT-ND; MANUFACTURER: Bourns Inc.; MOPN: 652-CAT16-100J4LF; MPN: CAT16-100J4LF; POWER: 1/16W; RESISTANCE: 10; TOLERANCE: 5%; VOLTAGE: 50V
RN8 = HyTechDevices:RESISTOR_NETWORK_4_*: Resistor Network, 4 Elements YC/TC Series CAT/CAY 16 Series; DKPN: CAT16-1000F4LFCT-ND; MANUFACTURER: Bourns Inc.; MOPN: 652-CAT16-1000F4LF; MPN: CAT16-1000F4LF; POWER: 1/16W; RESISTANCE: 100; TOLERANCE: 1%; VOLTAGE: 50V
RN9 = HyTechDevices:RESISTOR_NETWORK_4_*: Resistor Network, 4 Elements YC/TC Series CAT/CAY 16 Series; DKPN: 13-YC164-FR-071KLCT-ND; MANUFACTURER: Yageo; MOPN: 603-YC164-FR-071KL; MPN: YC164-FR-071KL; POWER: 1/16W; RESISTANCE: 1k; TOLERANCE: 1%; VOLTAGE: 50V
RV1-RV12 = HyTechDevices:RESISTOR_VALUE: Resistor for prototyping circuits
U1 U2 = HyTechDevices:CAN_TRANSCIEVER_TCAN337*: TCAN337 Can Tranciever Datasheet; DKPN: 296-48971-1-ND; MANUFACTURER: Texas Instruments; MOPN: 595-TCAN337GDCNR; MPN: TCAN337GDCNR
U3 = HyTechDevices:ADC128S022: ADC128S022 8-channel Analog to Digital Converter Datasheet; DKPN: 296-38561-1-ND; MANUFACTURER: Texas Instruments; MOPN: 926-A128S022CIMTXNPB; MPN: ADC128S022CIMTX/NOPB
U4-U13 U16 U17 U19 U20 U22 U23 U25-U27 = HyTechDevices:OPAMP_1_CHANNEL_*: Op-Amp 1 Channel OPA991 Datasheet Note: OPA991 is also a comparator; MPN: OPA991IDCKT
U14 = HyTechDevices:ADM823: ADM823 Watchdog Datasheet; DKPN: 505-ADM823TYKSZ-R7CT-ND; MANUFACTURER: Analog Devices Inc.; MOPN: 584-ADM823TYKSZ-R7; MPN: ADM823TYKSZ-R7; RESET_VOLTAGE: 3.08
U15 U18 U21 U24 = HyTechDevices:MAX74*: 8th-Order Maxim Filter MAX7480 Datasheet MAX7400 Datsheet MAX7404 uses a 680 pF clock capcitor; DKPN: MAX7404CSA+-ND; MANUFACTURER: Maxim Integrated; MOPN: 700-MAX7404CSA; MPN: MAX7404CSA+